# Altium project MA600_Angle_Encoder.PrjPcb
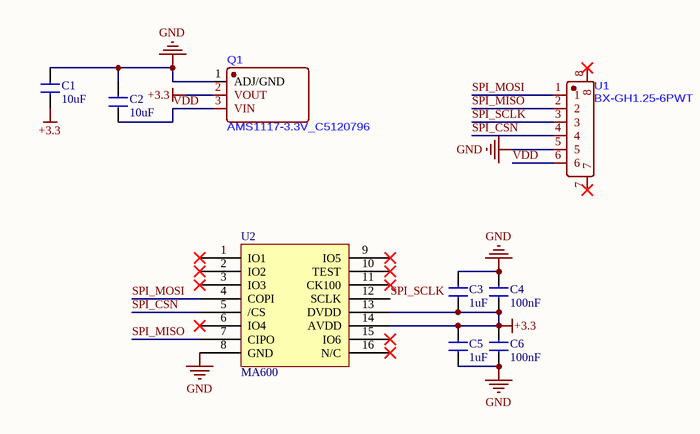
[diagram p0: MA600_Angle_Encoder.SchDoc]
1 sheet, 9 parts. Net scope: global (net labels, ports and power ports of the same name join across sheets).
Board file: MA600_Angle_Encoder.PcbDoc

## Sheet MA600_Angle_Encoder.SchDoc
size A4; SheetNumber: 1; SheetTotal: 1

### Parts
C1  10uF  [1210]
C2  10uF  [1210]
C3  1uF  [C0402]
C4  100nF  [C0402]
C5  1uF  [C0402]
C6  100nF  [C0402]
Q1  AMS1117-3.3V_C5120796  [SOT-89-3_L4.5-W2.5-P1.50-LS4.2-BR]
U1  BX-GH1.25-6PWT  [CONN-SMD_6P-P1.25_BX-GH1.25-6PWT]
U2  MA600  [qfn-16-l3.0-w3.0-p0.50-tl-ep1.7]

### Nets
+3.3: C1.1 C3.1 C4.1 C5.2 C6.2 Q1.2(VOUT) U2.13(DVDD) U2.14(AVDD)
GND: C1.2 C2.2 C3.2 C4.2 C5.1 C6.1 Q1.1(ADJ/GND) U1.5 U2.8(GND)
SPI_CSN: U1.4 U2.5(/CS)
SPI_MISO: U1.2 U2.7(CIPO)
SPI_MOSI: U1.1 U2.4(COPI)
SPI_SCLK: U1.3 U2.12(SCLK)
VDD: C2.1 Q1.3(VIN) U1.6

Not connected (* = marked no-connect by the designer): U1 7* 8*; U2 1(IO1)* 2(IO2)* 3(IO3)* 6(IO4)* 9(IO5)* 10(TEST)* 11(CK100)* 15(IO6)* 16(N/C)*

### Library data of the parts
C1 C2 = 1210贴片电容
C3-C6 = 0402贴片电容: 贴片电容0402
U2 = MA600: 磁编码器